# Altium project LNA_RF_Board.PrjPcb
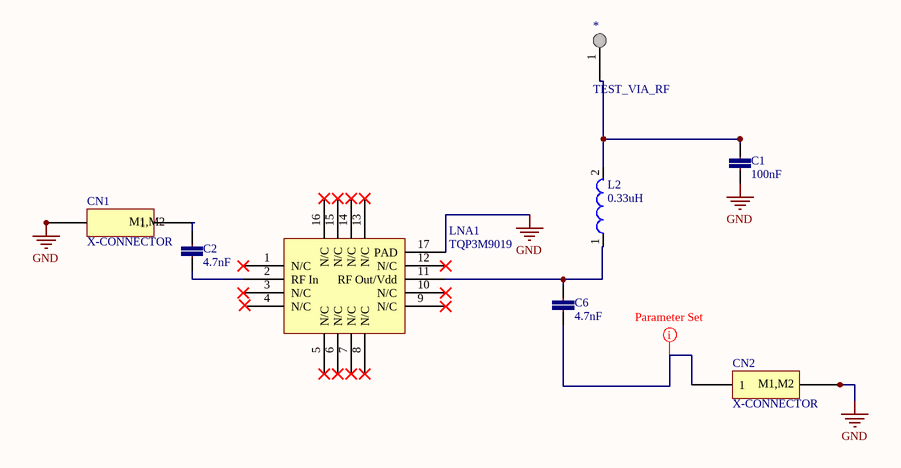
[diagram p0: LNA_RF_Sch.SchDoc]
1 sheet, 8 parts. Net scope: global (net labels, ports and power ports of the same name join across sheets).
Board file: LNA_RF_Board.PcbDoc

## Sheet LNA_RF_Sch.SchDoc
size A4; Organization1: VINCULADA AO EXÉRCITO BRASILEIRO; Organization2: FÁBRICA DE MATERIAL DE; Organization3: COMUNICAÇÕES E ELETRÔNICA; Organization0: INDÚSTRIA DE MATERIAL BÉLICO DO BRASIL

### Parts
*  TEST_VIA_RF  [New footprint 1]
C1  100nF  [CAPC0603(1608)55_L]
C2  4.7nF  [CAPC0603(1608)55_L]
C6  4.7nF  [CAPC0603(1608)55_L]
CN1  X-CONNECTOR  [X-CONNECTOR-PCB]
CN2  X-CONNECTOR  [X-CONNECTOR-PCB]
L2  0.33uH  [0603-IND]
LNA1  TQP3M9019  [QFN50P300X300X90_HS-17N]

### Nets
GND: C1.2 CN1.M1 CN1.M2 CN2.M1 CN2.M2 LNA1.17(PAD)
Net*_1: *.1 C1.1 L2.2
NetC2_1: C2.1 CN1.1
NetC2_2: C2.2 LNA1.2(RF_In)
NetC6_1: C6.1 L2.1 LNA1.11(RF_Out/Vdd)
NetC6_2: C6.2 CN2.1

Not connected (* = marked no-connect by the designer): LNA1 1(N/C)* 3(N/C)* 4(N/C) 5(N/C)* 6(N/C)* 7(N/C)* 8(N/C)* 9(N/C)* 10(N/C)* 12(N/C)* 13(N/C)* 14(N/C)* 15(N/C)* 16(N/C)*

### Layout directives
net class 50ohm: NetC6_2

### Notes on the sheet
- USADO EQUIP.:
- DATA:
- ENG:
- VERIF:
- HORA:
- REV:
- APROV:
- TÍTULO:
- FOLHA:
- /
- FORMATO:
- A4
- CÓDIGO:
- ESTOQUE:
- (in symbol X-CONNECTOR-5) M1,M2

### Library data of the parts
* = TEST_VIA_RF-01.A.1: Test VIA for RF circuits
C1 = CC0603-100nF-1: CAP CER 0.1UF 50V X7R 0603; Part No: GRM188R71H104KA93D; Value: 100nF
C2 C6 = CC0603-4.7nF-6: CAP CER 4700PF 50V 20% X7R 0603; Part No: GRM188R71H472MA01D; Cod EMS: 05.281.019.494; Value: 4.7n
CN1 CN2 = X-CONNECTOR-5: CONECTOR PARA MÓDULOS X MICROWAVE; RoHS: Yes; Mount: TH
L2 = 0603LS-331XJLB-3: Fixed Inductors RF Chip Inductor 0.33 uH 5 % 0.56 A; Cod EMS: 05.286.035.181; Family Description: INDUTORES FIXOS RF CHIP 47nH-22uH / 5% / SMD. P/N: 0603LS-...XJLB - COILCRAFT.; Part No: 0603LS-331XJLB; Family: 0603LS-...XJLB
LNA1 = TQP3M9019-01.A.1: RF Amplifier .05-4GHz P1dB= 22dB Gain 26.4dB 5Volts; Number of Channels: 1; Test Frequency: 1.9GHz; Frequency: 20MHz; Max Supply Voltage: 5.25V; Operating Supply Voltage: 5V; Min Supply Voltage: 4.75V; Operating Supply Current: 125mA; Gain: 22dB; Packaging: Tape and Reel; Package Quantity: 2500; Max Operating Temperature: 85°C; Weight: 0.002014oz; Case/Package: QFN; Mount: Surface Mount; Radiation Hardening: No; Number of Pins: 16; Min Operating Temperature: -40°C